# EAGLE design i2s-shifter_rev3-non_plated (EAGLE 7.3.0)
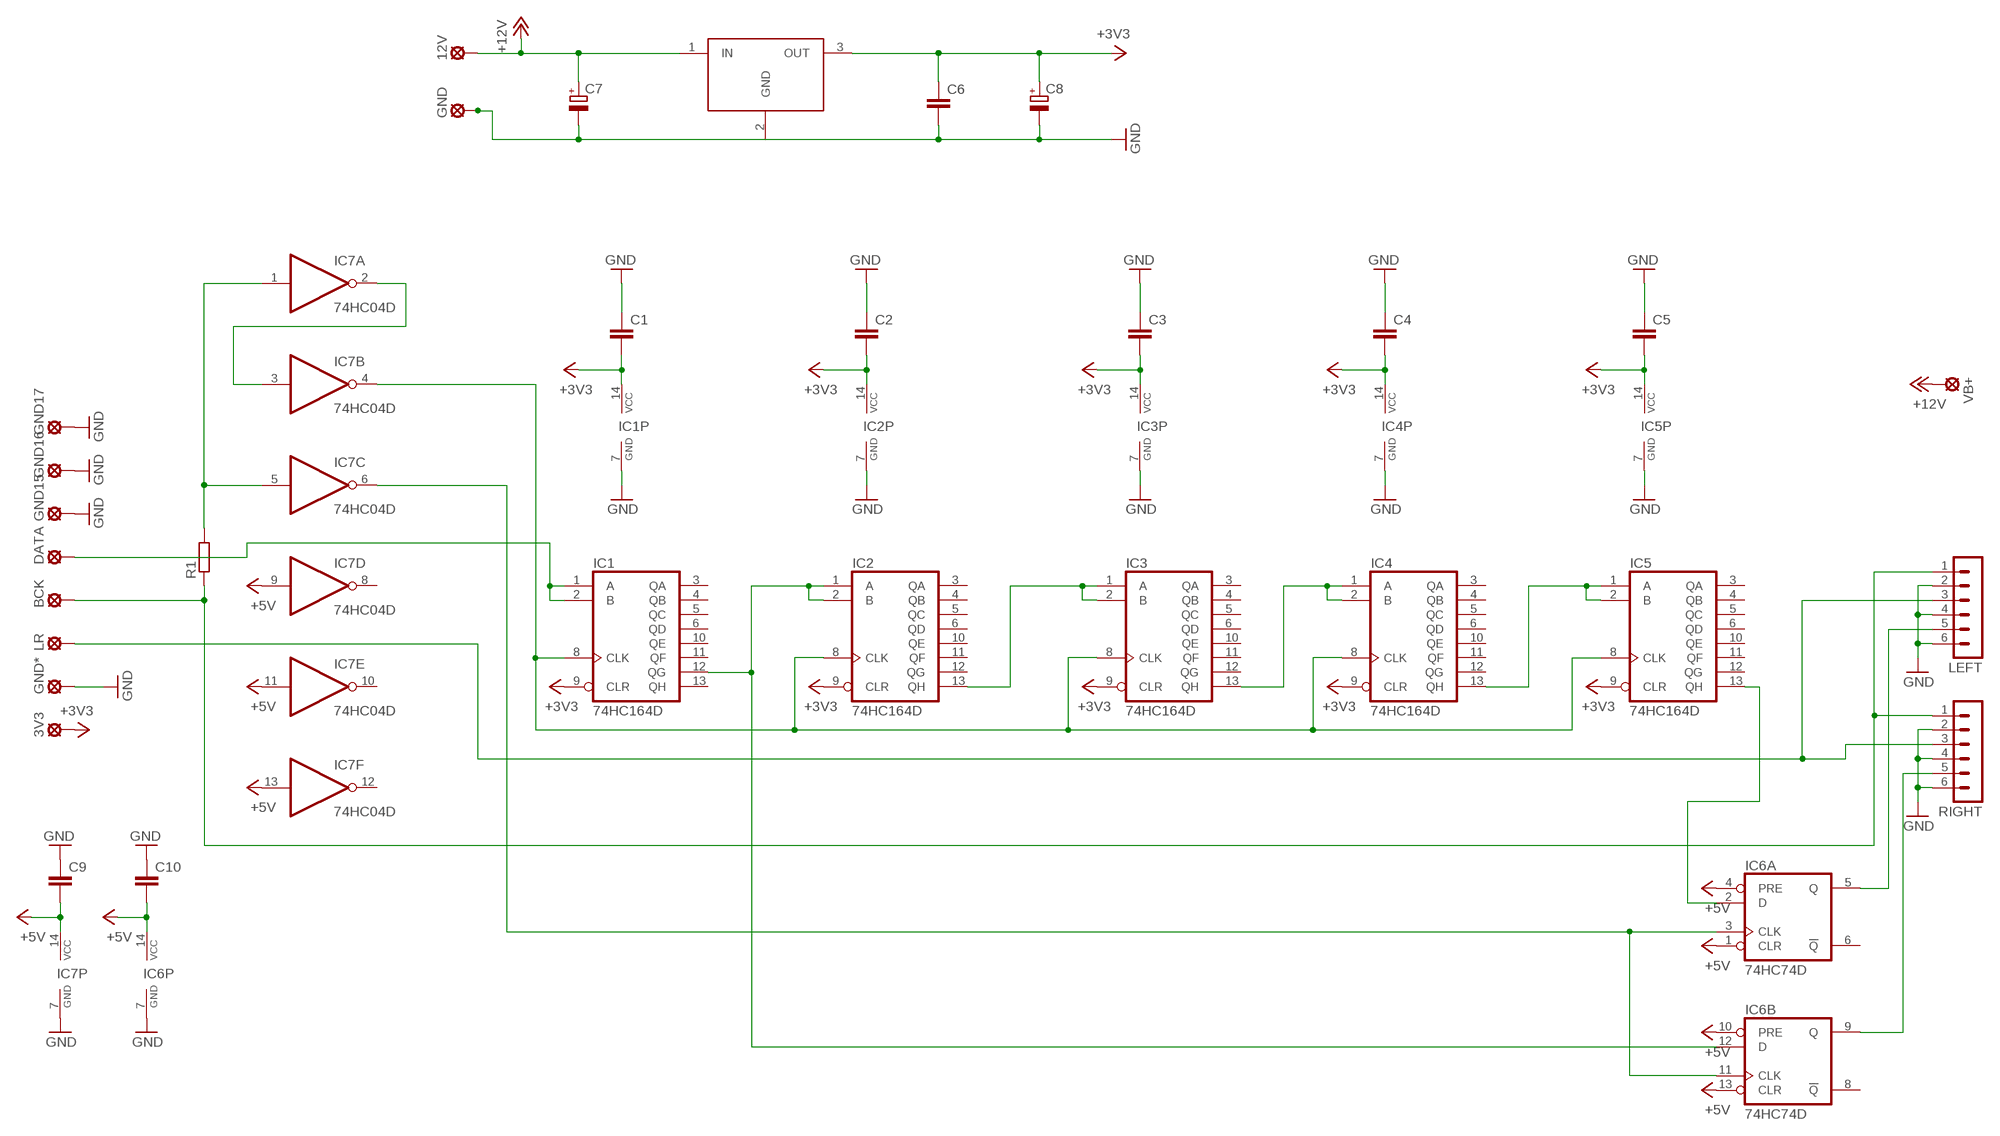
[diagram p0: schematic, sheet 1]

## Parts
3V3  LSP10  [LSP10]
12V  LSP10  [LSP10]
BCK  LSP10  [LSP10]
C1  C-EU050-025X075  [C050-025X075]
C2  C-EU050-025X075  [C050-025X075]
C3  C-EU050-025X075  [C050-025X075]
C4  C-EU050-025X075  [C050-025X075]
C5  C-EU050-025X075  [C050-025X075]
C6  C-EU050-025X075  [C050-025X075]
C7  CPOL-EUE7.5-16  [E7,5-16]
C8  CPOL-EUE5-10.5  [E5-10,5]
C9  C-EU050-025X075  [C050-025X075]
C10  C-EU050-025X075  [C050-025X075]
DATA  LSP10  [LSP10]
GND  LSP10  [LSP10]
GND15  LSP10  [LSP10]
GND16  LSP10  [LSP10]
GND17  LSP10  [LSP10]
GND*  LSP10  [LSP10]
IC1  74HC164D  [SO14]
IC2  74HC164D  [SO14]
IC3  74HC164D  [SO14]
IC4  74HC164D  [SO14]
IC5  74HC164D  [SO14]
IC6  74HC74D  [SO14]
IC7  74HC04D  [SO14]
IT1  LM3940IT-3.3  [TO220V]
LEFT  MA06-1  [MA06-1]
LR  LSP10  [LSP10]
R1  R-EU_0204/5  [0204/5]
RIGHT  MA06-1  [MA06-1]
VB+  LSP10  [LSP10]

## Nets
+3V3: 3V3.MP C1.2 C2.2 C3.2 C4.2 C5.2 C6.1 C8.+ IC1.9(CLR) IC1.14(VCC) IC2.9(CLR) IC2.14(VCC) IC3.9(CLR) IC3.14(VCC) IC4.9(CLR) IC4.14(VCC) IC5.9(CLR) IC5.14(VCC) IT1.3(OUT)
+5V: C9.2 C10.2 IC6.1(A:CLR) IC6.4(A:PRE) IC6.10(B:PRE) IC6.13(B:CLR) IC6.14(P:VCC) IC7.9(D:I) IC7.11(E:I) IC7.13(F:I) IC7.14(P:VCC)
+12V: 12V.MP C7.+ IT1.1(IN) VB+.MP
GND: C1.1 C2.1 C3.1 C4.1 C5.1 C6.2 C7.- C8.- C9.1 C10.1 GND15.MP GND16.MP GND17.MP GND*.MP GND.MP IC1.7(GND) IC2.7(GND) IC3.7(GND) IC4.7(GND) IC5.7(GND) IC6.7(P:GND) IC7.7(P:GND) LEFT.2 LEFT.4 LEFT.6 RIGHT.2 RIGHT.4 RIGHT.6
N$1: DATA.MP IC1.1(A) IC1.2(B)
N$2: IC1.8(CLK) IC2.8(CLK) IC3.8(CLK) IC4.8(CLK) IC5.8(CLK) IC7.4(B:O)
N$3: IC5.13(QH) IC6.2(A:D)
N$4: IC2.13(QH) IC3.1(A) IC3.2(B)
N$5: IC3.13(QH) IC4.1(A) IC4.2(B)
N$6: IC4.13(QH) IC5.1(A) IC5.2(B)
N$7: IC6.5(A:Q) LEFT.5
N$8: IC6.9(B:Q) RIGHT.5
N$9: LEFT.3 LR.MP RIGHT.3
N$10: BCK.MP LEFT.1 R1.1 RIGHT.1
N$11: IC7.2(A:O) IC7.3(B:I)
N$12: IC6.3(A:CLK) IC6.11(B:CLK) IC7.6(C:O)
N$13: IC1.12(QG) IC2.1(A) IC2.2(B) IC6.12(B:D)
N$14: IC7.1(A:I) IC7.5(C:I) R1.2
Unconnected: IC1.3(QA) IC1.4(QB) IC1.5(QC) IC1.6(QD) IC1.10(QE) IC1.11(QF) IC1.13(QH) IC2.3(QA) IC2.4(QB) IC2.5(QC) IC2.6(QD) IC2.10(QE) IC2.11(QF) IC2.12(QG) IC3.3(QA) IC3.4(QB) IC3.5(QC) IC3.6(QD) IC3.10(QE) IC3.11(QF) IC3.12(QG) IC4.3(QA) IC4.4(QB) IC4.5(QC) IC4.6(QD) IC4.10(QE) IC4.11(QF) IC4.12(QG) IC5.3(QA) IC5.4(QB) IC5.5(QC) IC5.6(QD) IC5.10(QE) IC5.11(QF) IC5.12(QG) IC6.6(A:!Q) IC6.8(B:!Q) IC7.8(D:O) IC7.10(E:O) IC7.12(F:O)

## Power pins joined to a net without a drawn wire
GND: IT1.2(GND)

## Library data of the parts
3V3 12V BCK DATA GND GND15-GND17 GND* LR VB+ = solpad:LSP10: SOLDER PAD drill 1.0 mm, distributor Buerklin, 12H555
C1-C6 C9 C10 = resistor:C-EU: CAPACITOR, European symbol
C7 C8 = resistor:CPOL-EU: POLARIZED CAPACITOR, European symbol
IC1-IC5 = 74xx-eu:74*164: 8-bit parallel out SHIFT REGISTER
IC6 = 74xx-eu:74*74: Dual D type positive edge triggered FLIP FLOP, preset and clear
IC7 = 74xx-eu:74*04: Hex INVERTER
IT1 = LM3940:LM3940IT-3.3: 1A Low Dropout Regulator for 5V to 3.3V Conversion
LEFT RIGHT = con-lstb:MA06-1: PIN HEADER; OC_FARNELL: unknown; OC_NEWARK: unknown
R1 = resistor:R-EU_: RESISTOR, European symbol

## Board
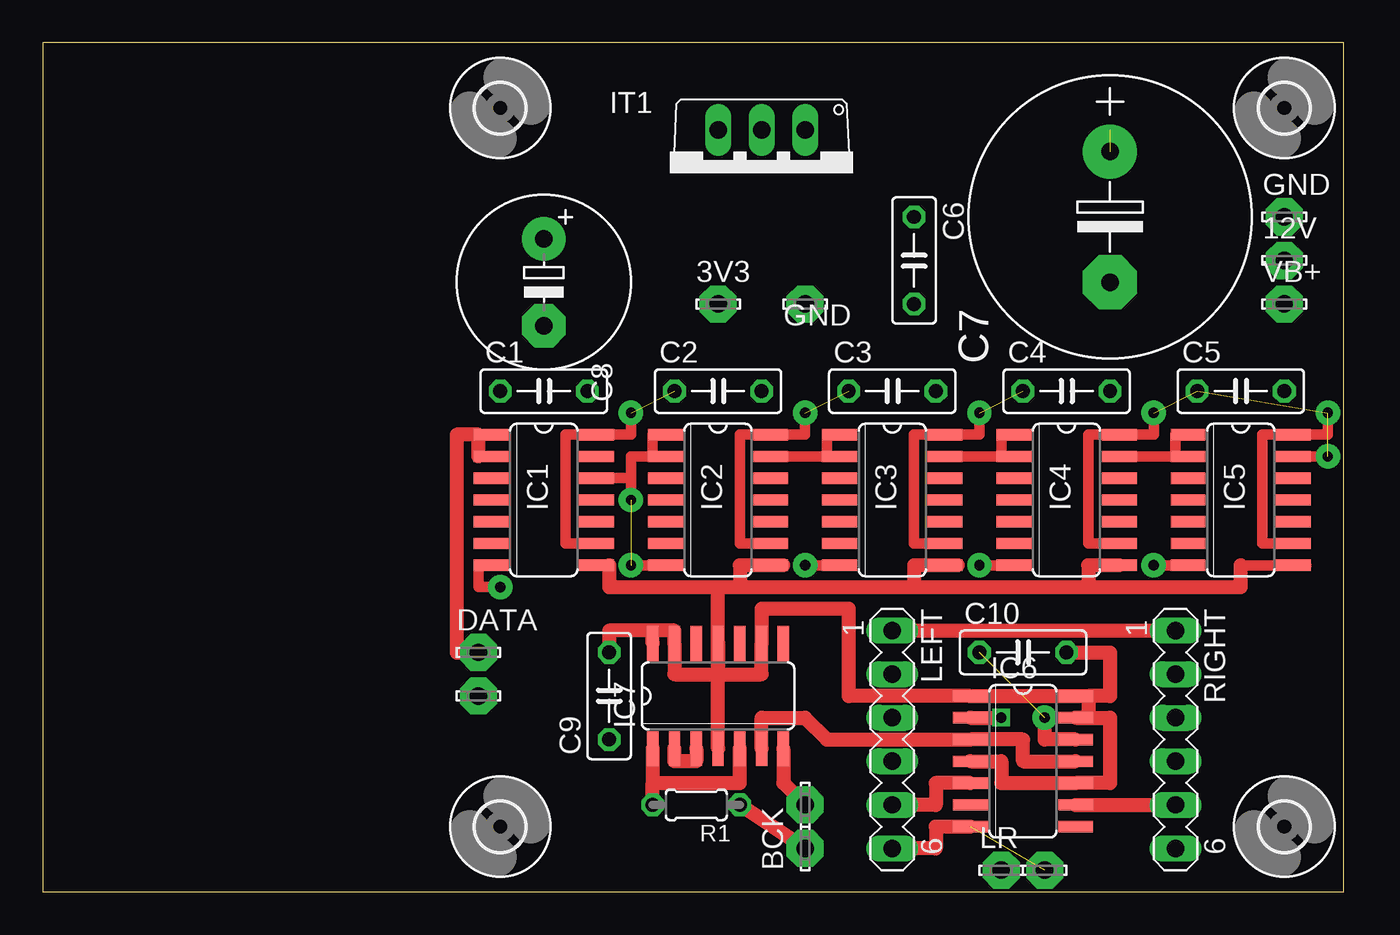
[diagram p1: board, top side]
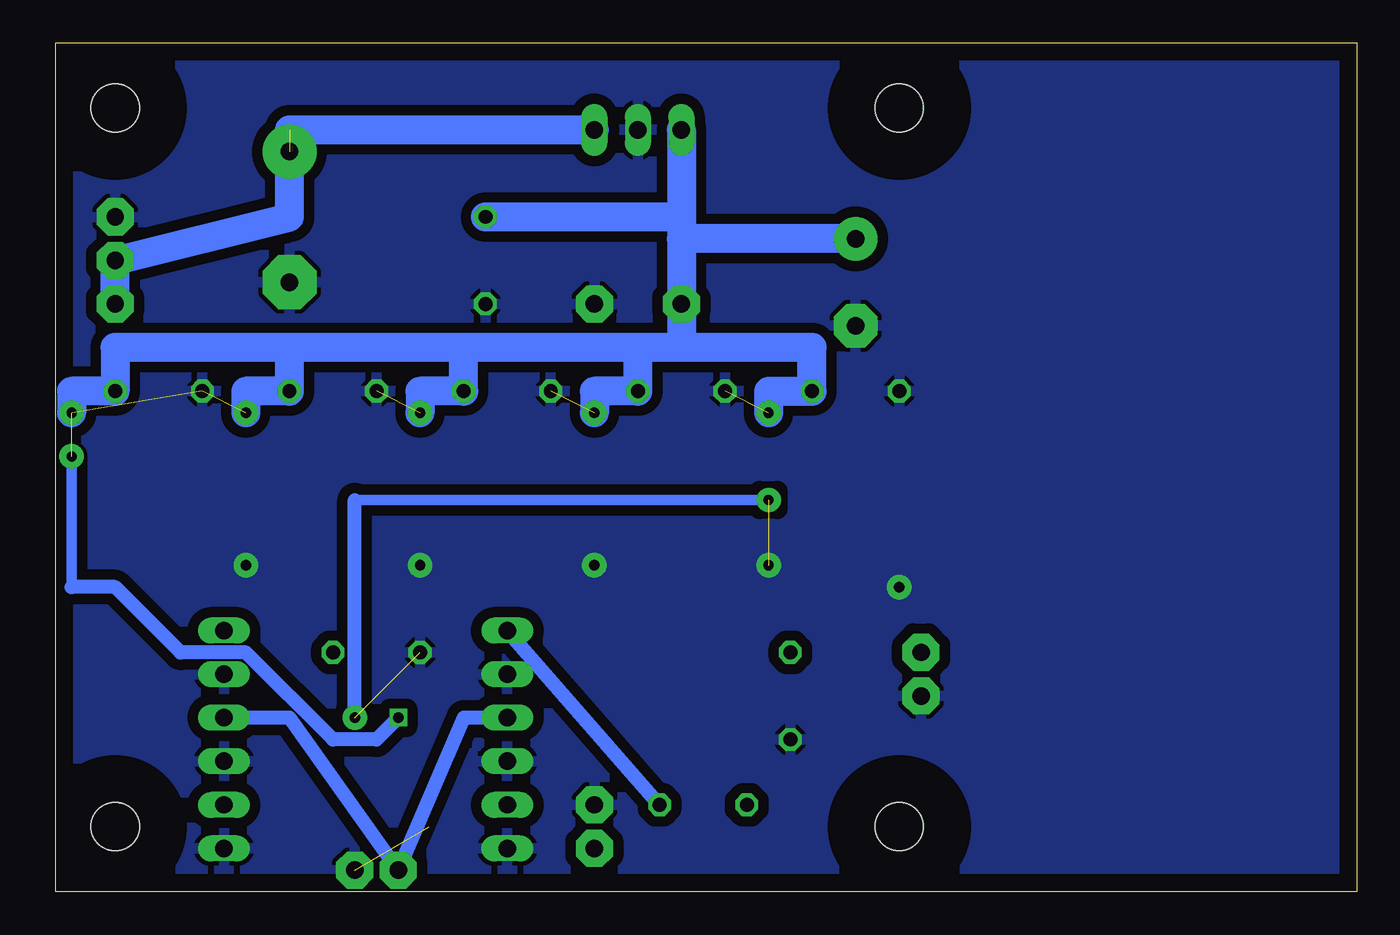
[diagram p2: board, bottom side, seen from below]

Size 75.87 x 49.52 mm. Coordinates in mm from the lower left corner, seen from the top.
Outline: 0,0 75.87,0 75.87,49.52 0,49.52 0,0
Copper layers (1*16): Top 0.035mm / dielectric 1.5mm / Bottom 0.035mm
Design rules "default": minimum track width 10mil, minimum drill 24mil, track to track 8mil, track to pad 8mil, pad to pad 8mil, via to via 8mil, smd to smd 8mil, copper to edge 40mil, drill to drill 8mil, minimum pad ring 10mil, minimum via ring 8mil, stop-mask expansion 4mil, vias tented up to drill 0mil, thermal gap 10mil

### Footprints (pad centres in the part's own frame; a part is rotated, then mirrored left to right if it is on the bottom)
LSP10 = drill 1.016 pad 2.159 octagon: MP 0,0
C050-025X075 = drill 0.813 octagon: 1 -2.54,0; 2 2.54,0
E7,5-16 = drill 1.016 pad 3.15: + -3.81,0 | drill 1.016 pad 3.15 octagon: - 3.81,0
E5-10,5 = drill 1.016 pad 2.54: + -2.54,0 | drill 1.016 pad 2.54 octagon: - 2.54,0
SO14 = smd 0.66 x 2.032: 1 -3.81,-3.073; 2 -2.54,-3.073; 3 -1.27,-3.073; 4 0,-3.073; 5 1.27,-3.073; 6 2.54,-3.073; 7 3.81,-3.073; 8 3.81,3.073; 9 2.54,3.073; 10 1.27,3.073; 11 0,3.073; 12 -1.27,3.073; 13 -2.54,3.073; 14 -3.81,3.073
TO220V = drill 1.016 long: 1 -2.54,-2.54; 2 0,-2.54; 3 2.54,-2.54
MA06-1 = drill 1.016 long: 1 -6.35,0; 2 -3.81,0; 3 -1.27,0; 4 1.27,0; 5 3.81,0; 6 6.35,0
0204/5 = drill 0.813 octagon: 1 -2.54,0; 2 2.54,0
2,8 = hole 2.8: 0,0

### Placement (x,y rotation side)
3V3  39.37,34.29 0 top
12V  72.39,36.83 0 top
BCK  44.45,2.54 90 top
C1  29.21,29.21 0 top
C2  39.37,29.21 0 top
C3  49.53,29.21 0 top
C4  59.69,29.21 0 top
C5  69.85,29.21 0 top
C6  50.8,36.83 270 top
C7  62.23,39.37 270 top
C8  29.21,35.56 270 top
C9  33.02,11.43 90 top
C10  57.15,13.97 0 top
DATA  25.4,13.97 0 top
GND  72.39,39.37 0 top
GND15  44.45,5.08 90 top
GND16  58.42,1.27 0 top
GND17  25.4,11.43 0 top
GND*  44.45,34.29 0 top
IC1  29.21,22.86 270 top
IC2  39.37,22.86 270 top
IC3  49.53,22.86 270 top
IC4  59.69,22.86 270 top
IC5  69.85,22.86 270 top
IC6  57.15,7.62 270 top
IC7  39.37,11.43 0 top
IT1  41.91,41.91 180 top
LEFT  49.53,8.89 270 top
LR  55.88,1.27 0 top
R1  38.1,5.08 180 top
RIGHT  66.04,8.89 270 top
U$1  [2,8]  26.67,45.72 0 top
U$2  [2,8]  72.39,45.72 0 top
U$3  [2,8]  72.39,3.81 0 top
U$4  [2,8]  26.67,3.81 0 top
VB+  72.39,34.29 0 top

### Tracks (layer width: path | path; a pad name or v marks a point on that pad's centre or on a via)
+3V3  (5 unrouted)
  Top 0.61: IC3.9 50.8,20.32 50.8,26.67 IC3.14 54.61,26.67 54.61,27.94 | IC4.9 60.96,20.32 60.96,26.67 IC4.14 64.77,26.67 64.77,27.94 | IC5.9 71.12,20.32 71.12,26.67 IC5.14 74.93,26.67 74.93,27.94 | IC2.9 40.64,20.32 40.64,26.67 IC2.14 44.45,26.67 44.45,27.94 | IC1.9 30.48,20.32 30.48,26.67 IC1.14 34.29,26.67 34.29,27.94
  Bottom 1.676: 41.91,31.75 52.07,31.75 | 52.07,31.75 62.23,31.75 | 62.23,31.75 72.39,31.75 C5.2 74.93,29.21 74.93,27.94 | 62.23,31.75 C4.2 64.77,29.21 64.77,27.94 | 52.07,31.75 C3.2 54.61,29.21 54.61,27.94 | 41.91,31.75 C2.2 44.45,29.21 44.45,27.94 | 34.29,27.94 34.29,29.21 C1.2 31.75,31.75 39.37,31.75 | 39.37,39.37 C6.1 | IT1.3 39.37,39.37 | 39.37,39.37 39.37,38.1 | 39.37,38.1 3V3.MP 39.37,31.75 | 39.37,31.75 41.91,31.75 | C8.+ 39.37,38.1
+5V
  Top 0.813: C10.2 62.23,13.97 62.23,11.43 60.96,11.43 | 60.96,11.43 IC6.14 IC6.1 46.99,11.43 46.99,16.51 41.91,16.51 IC7.9 41.91,12.7 39.37,12.7 | 60.96,11.43 60.96,10.16 IC6.13 62.23,10.16 62.23,6.35 IC6.10 55.88,6.35 55.88,7.62 IC6.4 | IC7.14 35.56,15.24 | 35.56,15.24 33.02,15.24 C9.2 | 35.56,15.24 36.83,15.24 IC7.13 36.83,12.7 39.37,12.7 | IC7.11 39.37,12.7
+12V  (1 unrouted)
  Bottom 1.676: VB+.MP 12V.MP 62.23,39.37 62.23,44.45 IT1.1
GND  (via drill 0.6 pad 1.42)  (9 unrouted)
  Top 0.406: v44.45,19.05 45.72,19.05 | 25.4,19.05 IC1.7 26.67,19.05 | 35.56,19.05 IC2.7
  Top 0.61: v54.61,19.05 IC4.7 | v26.67,17.78 25.4,17.78 25.4,19.05 | v34.29,19.05 35.56,19.05 | v44.45,19.05 IC3.7 | IC5.7 v64.77,19.05
  Top 0.813: IC7.7 43.18,6.35 GND15.MP | IC6.7 52.07,3.81 52.07,2.54 LEFT.6
  other vias: 34.29,27.94 44.45,27.94 54.61,27.94 64.77,27.94 74.93,27.94 34.29,22.86 74.93,25.4 58.42,10.16
  pour Bottom (isolate 0.61): 0,0 76.2,0 76.2,49.53 0,49.53
N$1
  Top 0.406: 25.4,26.67 IC1.1 | IC1.2 25.4,25.4
  Top 0.813: 25.4,25.4 25.4,26.67 24.13,26.67 24.13,13.97 DATA.MP
N$2
  Top 0.254: 53.34,19.05 IC3.8 | 73.66,19.05 IC5.8
  Top 0.406: IC4.8 63.5,19.05 | IC2.8 43.18,19.05
  Top 0.61: 69.85,19.05 73.66,19.05 | IC1.8 33.02,19.05
  Top 0.813: 39.37,17.78 33.02,17.78 33.02,19.05 | 39.37,17.78 40.64,17.78 | 40.64,17.78 50.8,17.78 | 50.8,17.78 60.96,17.78 | 60.96,17.78 69.85,17.78 69.85,19.05 | IC4.8 60.96,19.05 60.96,17.78 | 53.34,19.05 50.8,19.05 50.8,17.78 | 43.18,19.05 40.64,19.05 40.64,17.78 | IC7.4 39.37,17.78
N$3  (via drill 0.6)  (1 unrouted)
  Top 0.61: IC5.13 74.93,25.4
  Top 0.813: IC6.2 v55.88,10.16
  Bottom 0.61: 74.93,25.4 74.93,17.78
  Bottom 0.813: v55.88,10.16 57.15,8.89 59.69,8.89 64.77,13.97 68.58,13.97 72.39,17.78 74.93,17.78
N$4
  Top 0.406: IC3.2 45.72,25.4 | 45.72,26.67 IC3.1
  Top 0.61: IC2.13 45.72,25.4 45.72,26.67
N$5
  Top 0.406: IC4.2 55.88,25.4 | IC4.1 55.88,26.67
  Top 0.61: IC4.2 IC3.13 | 55.88,25.4 55.88,26.67
N$6
  Top 0.406: 66.04,25.4 IC5.2 | IC5.1 66.04,26.67
  Top 0.61: IC4.13 66.04,25.4 66.04,26.67
N$7
  Top 0.813: IC6.5 52.07,6.35 52.07,5.08 LEFT.5
N$8
  Top 0.813: IC6.9 RIGHT.5
N$9
  Bottom 0.813: LEFT.3 52.07,10.16 LR.MP 62.23,10.16 RIGHT.3
N$10
  Top 0.813: BCK.MP R1.1 | LEFT.1 RIGHT.1
  Bottom 0.813: R1.1 LEFT.1
N$11
  Top 0.813: IC7.3 38.1,7.62 36.83,7.62 IC7.2
N$12
  Top 0.813: IC6.11 57.15,7.62 57.15,8.89 IC6.3 45.72,8.89 44.45,10.16 41.91,10.16 IC7.6
N$13  (via drill 0.6)
  Top 0.61: 34.29,24.13 34.29,25.4 IC2.2 35.56,25.4 35.56,26.67 IC2.1 | IC1.12 34.29,24.13 | 34.29,24.13 v34.29,22.86
  Top 0.813: IC6.12 58.42,8.89 v58.42,10.16
  Bottom 0.61: v34.29,22.86 58.42,22.86
  Bottom 0.813: v58.42,10.16 58.42,22.86
N$14
  Top 0.813: R1.2 35.56,6.35 | IC7.1 35.56,6.35 | 35.56,6.35 40.64,6.35 IC7.5

### Text on the board
tNames: GND